# Altium schematic sheet 05-GPS_IMU_SENSORS.SchDoc
size Tabloid; Customer: 01910; SPICEModelCache: <root> / <DocumentId>YSTRYKDD</DocumentId> / <CacheFrame Number="0"> / <Model Name="emk105bj105_v-f" Kind="CKT"> / <Text>* EMK105BJ105_V-F     SPICE MODEL  ( General Type ) / *-------------------------------------------------------------------------------------------------------- / * Model Generated by TAIYO YUDEN Corporation (http://www.ty-top.com) / * Version 1.0 / * TAIYO YUDEN Control No. 170508_130520 / * Copyright(c) 2012 TAIYO YUDEN CO.,LTD. All Rights Reserved. / *-------------------------------------------------------------------------------------------------------- / * / * Products Name : Multilayer Ceramic Capacitors / * / * Characteristics : / *     Capacitance : 1 uF , Rated Voltage : 16V , TCC : X5R / *     Case Size : 1.0 x 0.5 / 0.039 x 0.02 [mm/inch] , Thickness : 0.5 / 0.02 [mm/inch] / *     (Conditions: Temperature = 25 degC , DC Bias Current/Voltage = 0A / 0V) / * / * Frequency Range : 40Hz - 3GHz / * / * External Node Assignments : / * / *  1  o---| |---o  2 / * / *-------------------------------------------------------------------------------------------------------- / .SubCkt EMK105BJ105_V-F 1 2 / **************************** / C0 1 110 0.68309u / Cm 1 101 0.26053u / C1 101 102 0.94076u / Rc1 101 102 1.9029k / C2 102 103 0.66707u / Rc2 102 103 120.36 / C3 103 110 0.57203u / Rc3 103 110 2.1097 / C2m 1 301 0.1871u / C21 301 302 3.2494u / Rc21 301 302 1.1117k / C22 302 303 2.1014u / Rc22 302 303 1.484k / C23 303 304 2.1172u / Rc23 303 304 1.3876k / C24 304 305 0.75729u / Rc24 304 305 332.59 / C25 305 306 0.94401u / Rc25 305 306 249.09 / C26 306 307 0.34674u / Rc26 306 307 28.352 / C27 307 308 0.37158u / Rc27 307 308 19.989 / C28 308 309 0.17933u / Rc28 308 309 31.748 / C29 309 110 0.016445u / Rc29 309 110 1.0592 / Rp0 1 110 100Meg / L0 110 120 0.2216n / Lm 120 130 0.1509n / L1 120 121 0.12659n / RL1 121 130 0.85161 / L2 120 122 0.15996n / RL2 122 130 0.42469 / L3 120 123 7.9543n / RL3 123 130 0.54643m / CR 120 124 0.24334u / LR 124 125 0.090738n / RR 125 130 68.076m / CL 130 140 2.7354p / LL 130 140 0.10762n / RL 130 140 50.614 / Rs 140 2 7.5416m / **************************** / .ends EMK105BJ105_V-F</Text> / </Model> / </CacheFrame> / </root>
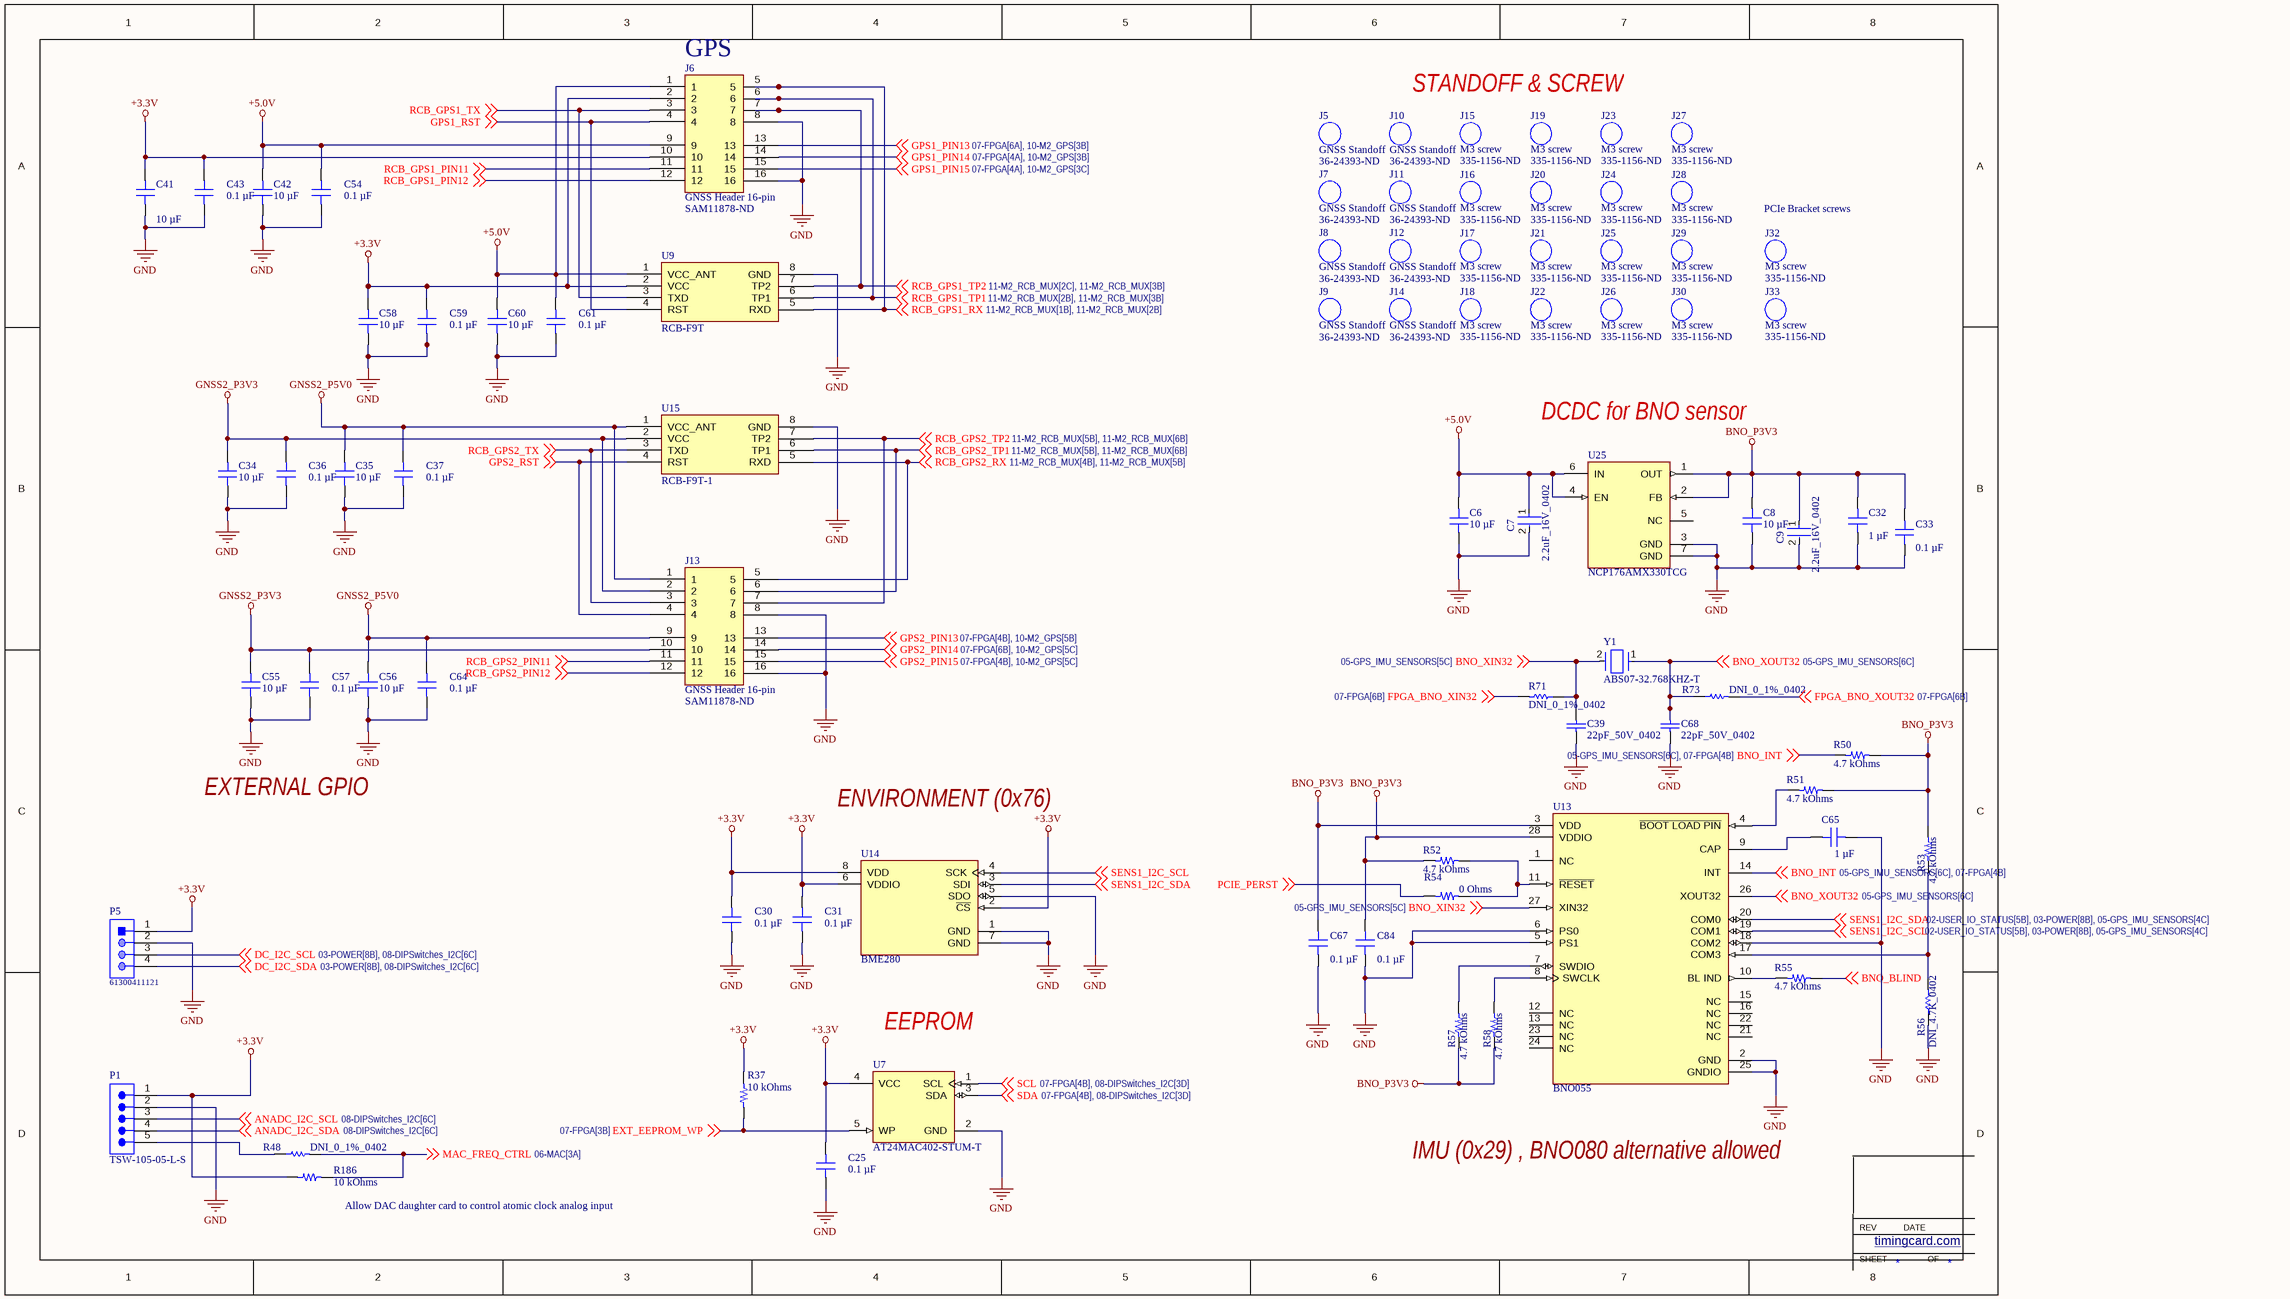
[diagram p0: 05-GPS_IMU_SENSORS.SchDoc]

## Parts
C6  10 µF  [MURATA GRM21B 0805_2012]
C7  2.2uF_16V_0402  [FP-C1005-050-0_05-IPC_A]
C8  10 µF  [MURATA GRM21B 0805_2012]
C9  2.2uF_16V_0402  [FP-C1005-050-0_05-IPC_A]
C25  0.1 µF  [CAP 0402_1005]
C30  0.1 µF  [CAP 0402_1005]
C31  0.1 µF  [CAP 0402_1005]
C32  1 µF  [CAP 0402_1005]
C33  0.1 µF  [CAP 0402_1005]
C34  10 µF  [MURATA GRM21B 0805_2012]
C35  10 µF  [MURATA GRM21B 0805_2012]
C36  0.1 µF  [CAP 0402_1005]
C37  0.1 µF  [CAP 0402_1005]
C39  22pF_50V_0402  [CAPC1005X55X25ML05T05]
C41  10 µF  [MURATA GRM21B 0805_2012]
C42  10 µF  [MURATA GRM21B 0805_2012]
C43  0.1 µF  [CAP 0402_1005]
C54  0.1 µF  [CAP 0402_1005]
C55  10 µF  [MURATA GRM21B 0805_2012]
C56  10 µF  [MURATA GRM21B 0805_2012]
C57  0.1 µF  [CAP 0402_1005]
C58  10 µF  [MURATA GRM21B 0805_2012]
C59  0.1 µF  [CAP 0402_1005]
C60  10 µF  [MURATA GRM21B 0805_2012]
C61  0.1 µF  [CAP 0402_1005]
C64  0.1 µF  [CAP 0402_1005]
C65  1 µF  [CAP 0402_1005]
C67  0.1 µF  [CAP 0402_1005]
C68  22pF_50V_0402  [CAPC1005X55X25ML05T05]
C84  0.1 µF  [CAP 0402_1005]
J5  GNSS Standoff  Supplier Part Number 1: 36-24393-ND
J6  GNSS Header 16-pin  Supplier Part Number 1: SAM11878-ND  [GNSS Header 16-pin]
J7  GNSS Standoff  Supplier Part Number 1: 36-24393-ND
J8  GNSS Standoff  Supplier Part Number 1: 36-24393-ND
J9  GNSS Standoff  Supplier Part Number 1: 36-24393-ND
J10  GNSS Standoff  Supplier Part Number 1: 36-24393-ND
J11  GNSS Standoff  Supplier Part Number 1: 36-24393-ND
J12  GNSS Standoff  Supplier Part Number 1: 36-24393-ND
J13  GNSS Header 16-pin  Supplier Part Number 1: SAM11878-ND  [GNSS Header 16-pin]
J14  GNSS Standoff  Supplier Part Number 1: 36-24393-ND
J15  M3 screw  Supplier Part Number 1: 335-1156-ND
J16  M3 screw  Supplier Part Number 1: 335-1156-ND
J17  M3 screw  Supplier Part Number 1: 335-1156-ND
J18  M3 screw  Supplier Part Number 1: 335-1156-ND
J19  M3 screw  Supplier Part Number 1: 335-1156-ND
J20  M3 screw  Supplier Part Number 1: 335-1156-ND
J21  M3 screw  Supplier Part Number 1: 335-1156-ND
J22  M3 screw  Supplier Part Number 1: 335-1156-ND
J23  M3 screw  Supplier Part Number 1: 335-1156-ND
J24  M3 screw  Supplier Part Number 1: 335-1156-ND
J25  M3 screw  Supplier Part Number 1: 335-1156-ND
J26  M3 screw  Supplier Part Number 1: 335-1156-ND
J27  M3 screw  Supplier Part Number 1: 335-1156-ND
J28  M3 screw  Supplier Part Number 1: 335-1156-ND
J29  M3 screw  Supplier Part Number 1: 335-1156-ND
J30  M3 screw  Supplier Part Number 1: 335-1156-ND
J32  M3 screw  Supplier Part Number 1: 335-1156-ND
J33  M3 screw  Supplier Part Number 1: 335-1156-ND
P1  TSW-105-05-L-S  [SMTC-TSW-105-05-X-S]
P5  61300411121  [61300411121]
R37  10 kOhms  [YAGEO RES 0402_1005]
R48  DNI_0_1%_0402  [RESC1005X40X25LL05T05]  (no BOM)
R50  4.7 kOhms  [YAGEO RES 0402_1005]
R51  4.7 kOhms  [YAGEO RES 0402_1005]
R52  4.7 kOhms  [YAGEO RES 0402_1005]
R53  4.7 kOhms  [YAGEO RES 0402_1005]
R54  0 Ohms  [YAGEO RES 0402_1005]
R55  4.7 kOhms  [YAGEO RES 0402_1005]
R56  DNI_4.7K_0402  [RESC1005X40X25LL05T05]  (no BOM)
R57  4.7 kOhms  [YAGEO RES 0402_1005]
R58  4.7 kOhms  [YAGEO RES 0402_1005]
R71  DNI_0_1%_0402  [RESC1005X40X25LL05T05]  (no BOM)
R73  DNI_0_1%_0402  [RESC1005X40X25LL05T05]  (no BOM)
R186  10 kOhms  [YAGEO RES 0402_1005]
U7  AT24MAC402-STUM-T  [FP-5TS1-IPC_C]
U9  RCB-F9T  [GNSS]
U13  BNO055  [FP-BNO055-MFG]
U14  BME280  [FP-BME280-MFG]
U15  RCB-F9T-1  [GNSS]
U25  NCP176AMX330TCG  [FP-711AT-MFG]
Y1  ABS07-32.768KHZ-T  [FP-ABS07-MFG]

## Nets
+3.3V: C25.2 C30.2 C31.2 C41.2 C43.2 C58.2 C59.2 J6.2 J6.10 P1.1 P5.1 R37.2 R186.1 U7.4(VCC) U9.2(VCC) U14.2(~{CS}) U14.6(VDDIO) U14.8(VDD)
+5.0V: C6.2 C7.1 C42.2 C54.2 C60.2 C61.2 J6.1 J6.9 U9.1(VCC_ANT) U25.4(EN) U25.6(IN)
BNO_P3V3: C8.2 C9.1 C32.2 C33.1 C67.2 C84.2 R50.1 R51.1 R52.2 R53.2 R57.1 R58.1 U13.3(VDD) U13.28(VDDIO) U25.1(OUT) U25.2(FB)
GND: C6.1 C7.2 C8.1 C9.2 C25.1 C30.1 C31.1 C32.1 C33.2 C34.1 C35.1 C36.1 C37.1 C39.1 C41.1 C42.1 C43.1 C54.1 C55.1 C56.1 C57.1 C58.1 C59.1 C60.1 C61.1 C64.1 C65.1 C67.1 C68.1 C84.1 J6.8 J6.16 J13.8 J13.16 P1.2 P5.2 R56.1 U7.2(GND) U9.8(GND) U13.2(GND) U13.5(PS1) U13.6(PS0) U13.18(COM2) U13.25(GNDIO) U14.1(GND) U14.5(SDO) U14.7(GND) U15.8(GND) U25.3(GND) U25.7(GND)
GNSS2_P3V3: C34.2 C36.2 C55.2 C57.2 J13.2 J13.10 U15.2(VCC)
GNSS2_P5V0: C35.2 C37.2 C56.2 C64.2 J13.1 J13.9 U15.1(VCC_ANT)
ANADC_I2C_SCL: P1.3 ; off-sheet ANADC_I2C_SCL
ANADC_I2C_SDA: P1.4 ; off-sheet ANADC_I2C_SDA
BNO_BLIND: R55.1 ; off-sheet BNO_BLIND
BNO_INT: R50.2 U13.14(INT) ; off-sheet BNO_INT
BNO_XIN32: C39.2 R71.1 U13.27(XIN32) Y1.2 ; off-sheet BNO_XIN32
BNO_XOUT32: C68.2 R73.1 U13.26(XOUT32) Y1.1 ; off-sheet BNO_XOUT32
DC_I2C_SCL: P5.3 ; off-sheet DC_I2C_SCL
DC_I2C_SDA: P5.4 ; off-sheet DC_I2C_SDA
EXT_EEPROM_WP: R37.1 U7.5(WP) ; off-sheet EXT_EEPROM_WP
FPGA_BNO_XIN32: R71.2 ; off-sheet FPGA_BNO_XIN32
FPGA_BNO_XOUT32: R73.2 ; off-sheet FPGA_BNO_XOUT32
GPS1_PIN13: J6.13 ; off-sheet GPS1_PIN13
GPS1_PIN14: J6.14 ; off-sheet GPS1_PIN14
GPS1_PIN15: J6.15 ; off-sheet GPS1_PIN15
GPS1_RST: J6.4 U9.4(RST) ; off-sheet GPS1_RST
GPS2_PIN13: J13.13 ; off-sheet GPS2_PIN13
GPS2_PIN14: J13.14 ; off-sheet GPS2_PIN14
GPS2_PIN15: J13.15 ; off-sheet GPS2_PIN15
GPS2_RST: J13.4 U15.4(RST) ; off-sheet GPS2_RST
MAC_FREQ_CTRL: R48.2 R186.2 ; off-sheet MAC_FREQ_CTRL
PCIE_PERST: R54.1 ; off-sheet PCIE_PERST
RCB_GPS1_PIN11: J6.11 ; off-sheet RCB_GPS1_PIN11
RCB_GPS1_PIN12: J6.12 ; off-sheet RCB_GPS1_PIN12
RCB_GPS1_RX: J6.5 U9.5(RXD) ; off-sheet RCB_GPS1_RX
RCB_GPS1_TP1: J6.6 U9.6(TP1) ; off-sheet RCB_GPS1_TP1
RCB_GPS1_TP2: J6.7 U9.7(TP2) ; off-sheet RCB_GPS1_TP2
RCB_GPS1_TX: J6.3 U9.3(TXD) ; off-sheet RCB_GPS1_TX
RCB_GPS2_PIN11: J13.11 ; off-sheet RCB_GPS2_PIN11
RCB_GPS2_PIN12: J13.12 ; off-sheet RCB_GPS2_PIN12
RCB_GPS2_RX: J13.5 U15.5(RXD) ; off-sheet RCB_GPS2_RX
RCB_GPS2_TP1: J13.6 U15.6(TP1) ; off-sheet RCB_GPS2_TP1
RCB_GPS2_TP2: J13.7 U15.7(TP2) ; off-sheet RCB_GPS2_TP2
RCB_GPS2_TX: J13.3 U15.3(TXD) ; off-sheet RCB_GPS2_TX
SCL: U7.1(SCL) ; off-sheet SCL
SDA: U7.3(SDA) ; off-sheet SDA
SENS1_I2C_SCL: U13.19(COM1) U14.4(SCK) ; off-sheet SENS1_I2C_SCL
SENS1_I2C_SDA: U13.20(COM0) U14.3(SDI) ; off-sheet SENS1_I2C_SDA
NetC65_2: C65.2 U13.9(CAP)
NetP1_5: P1.5 R48.1
NetR51_2: R51.2 U13.4(~{BOOT_LOAD_PIN})
NetR52_1: R52.1 R54.2 U13.11(~{RESET})
NetR53_1: R53.1 R56.2 U13.17(COM3)
NetR55_2: R55.2 U13.10(BL_IND)
NetR57_2: R57.2 U13.7(SWDIO)
NetR58_2: R58.2 U13.8(SWCLK)

Not connected (* = marked no-connect by the designer): U13 1(NC) 12(NC) 13(NC) 15(NC) 16(NC) 21(NC) 22(NC) 23(NC) 24(NC); U25 5(NC)

## Notes on the sheet
- (near J6) GPS
- STANDOFF & SCREW
- (near J32) PCIe Bracket screws
- DCDC for BNO sensor
- EXTERNAL GPIO
- ENVIRONMENT (0x76)
- EEPROM
- IMU (0x29) , BNO080 alternative allowed
- (near R186) Allow DAC daughter card to control atomic clock analog input
- SHEET
- REV
- timingcard.com <http://timingcard.com>
- DATE
- OF

## Library data of the parts
C6 C8 C34 C35 C41 C42 C55 C56 C58 C60 = GRM21BR61E106KA73L: CAP CER 10UF 25V X5R 0805; manufacturer: Murata Electronics; Tolerance: ±10%; packaging: TapeAndReel; Capacitance: 10 µF; series: GRM; Part Number: GRM21BR61E106KA73L; Value: 10 µF; Applications: General Purpose; componentlink1description: Datasheet; componentlink1url: https://search.murata.co.jp/Ceramy/image/img/A01X/G101/ENG/GRM21BR61E106KA73-01.pdf; componentlink2description: DigiKey Link; componentlink2url: https://www.digikey.com/en/products/detail/murata-electronics/GRM21BR61E106KA73L/2334874; Device Package: 0805 (2012 Metric); lastupdated: 27.08.2024 9:29:56; Lifecycle Status: Active; Minimum Order: 1; Mounting Type: Surface Mount, MLCC; Operating Temperature: -55°C ~ 85°C; Package / Case: 0805 (2012 Metric); partid: 8913; Part Status: Active; price: 0.04; Size / Dimension: 0.079" L x 0.049" W (2.00mm x 1.25mm); Supplier 1: DigiKey; Supplier Part Number 1: 490-5523-1-ND; Temperature Coefficient: X5R; Thickness (Max): 0.053" (1.35mm); Voltage - Rated: 25V
C7 C9 = CMP-2000-05998-2: Multilayer Ceramic Capacitors 2.2μF ±10% 16V X5R SMD 0402; Capacitance: 2.2uF; REACH SVHC: No SVHC; Series: C; Termination: SMD/SMT; Case Code (Imperial): 0402; Depth: 0.5mm; Mount: Surface Mount; Width: 0.02inch; Package Quantity: 1; Dielectric Material: Ceramic; Length: 1mm; Packaging: Tape and Reel; Case Code (Metric): 1005; RoHS Compliant: Yes; Dielectric: X5R; Max Operating Temperature: 85°C; Lead Free: Lead Free; Weight: 2.3E-05oz; Thickness: 0.022inch; Voltage Rating (DC): 16V; Tolerance: 10%; Voltage Rating: 16V; Resistor Type: Ceramic; Height: 0.5mm; Case/Package: 0402; Min Operating Temperature: -55°C
C25 C30 C31 C33 C36 C37 C43 C54 C57 C59 C61 C64 C67 C84 = CC0402KRX7R9BB104: CAP CER 0.1UF 50V X7R 0402; manufacturer: Yageo; Tolerance: ±10%; Part Number: CC0402KRX7R9BB104; Value: 0.1 µF; Applications: General Purpose; Capacitance: 0.1 µF; componentlink1description: Datasheet; componentlink1url: https://www.yageo.com/upload/media/product/productsearch/datasheet/mlcc/UPY-GPHC_X7R_6.3V-to-50V_18.pdf; componentlink2description: DigiKey Link; componentlink2url: https://www.digikey.com/en/products/detail/yageo/CC0402KRX7R9BB104/5883371; Device Package: 0402 (1005 Metric); lastupdated: 09.02.2024 20:04:27; Lifecycle Status: Active; Minimum Order: 10; Mounting Type: Surface Mount, MLCC; Operating Temperature: -55°C ~ 125°C; Package / Case: 0402 (1005 Metric); packaging: TapeAndReel; partid: 8451; Part Status: Active; price: 0.01; series: CC; Size / Dimension: 0.039" L x 0.020" W (1.00mm x 0.50mm); Supplier 1: DigiKey; Supplier Part Number 1: 311-3566-1-ND; Temperature Coefficient: X7R; Thickness (Max): 0.022" (0.55mm); Voltage - Rated: 50V
C32 C65 = CC0402KRX5R8BB105: CAP CER 1UF 25V X5R 0402; manufacturer: Yageo; Tolerance: ±10%; packaging: TapeAndReel; series: CC; Capacitance: 1 µF; Part Number: CC0402KRX5R8BB105; Value: 1 µF; Applications: General Purpose; componentlink1description: Datasheet; componentlink1url: https://www.yageo.com/upload/media/product/productsearch/datasheet/mlcc/UPY-GPHC_X5R_4V-to-50V_25.pdf; componentlink2description: DigiKey Link; componentlink2url: https://www.digikey.com/en/products/detail/yageo/CC0402KRX5R8BB105/5195107; Device Package: 0402 (1005 Metric); lastupdated: 09.02.2024 20:04:25; Lifecycle Status: Active; Minimum Order: 1; Mounting Type: Surface Mount, MLCC; Operating Temperature: -55°C ~ 85°C; Package / Case: 0402 (1005 Metric); partid: 9641; Part Status: Active; price: 0.04; Size / Dimension: 0.039" L x 0.020" W (1.00mm x 0.50mm); Supplier 1: DigiKey; Supplier Part Number 1: 311-1698-1-ND; Temperature Coefficient: X5R; Thickness (Max): 0.022" (0.55mm); Voltage - Rated: 25V
C39 C68 = CMP-2100-03590-1: Chip Capacitor, 22 pF, +/- 5%, 50 V, -55 to 125 degC, 0402 (1005 Metric), RoHS, Tape and Reel; Manufacturer: Yageo; Voltage Rating: 50V; Dielectric Material: Ceramic; Capacitance: 22pF; Temperature Coefficient: 30ppm/degC; Dielectric: C0G; Insulation Resistance: 100GR; Datasheet URL: http://www.yageo.com/NewPortal/yageodocoutput?fileName=/pdf/MLCC/UPY-GP_NP0_16V-to-50V_14.pdf; Depth: 0.5mm; Number of Pins: 2; Height: 0.5mm; Min Operating Temperature: -55degC; REACH SVHC: NoSVHC; Max Operating Temperature: 125degC; Voltage Rating (DC): 50V; Composition: Ceramic; Packaging: TapeandReel; Package Quantity: 1; Package Reference: 0402; Length: 1mm; Radiation Hardening: No; Package Description: 2-Pin Surface Mount Device, Body 1 x 0.5 mm; RoHSCompliant: True; Thickness: 0.022inch; Manufacturer URL: http://www.yageo.com/; Mount: SurfaceMount; Case Code (Metric): 1005; Case/Package: 0402; Tolerance: 5%; Termination: SMD/SMT; Width: 0.02inch; Datasheet Version: Rev. 14, 07/2016; Lead Free: LeadFree; Case Code (Imperial): 0402
P1 = CMP-1024-00366-1: 0.025" SQ Post Header, Through-hole, Vertical, -55 to 125 degC, 2.54 mm Pitch, 5-Pin, Male, RoHS; Manufacturer: Samtec; Pitch: 2.54 mm; PackageVersion: DM, 8/1988; PartNumber: TSW-105-05-L-S; Orientation: Vertical; Temperature Range: -55 to 125 degC; ComponentLink1Description: Manufacturer URL; PackageDescription: .025[0.64] SQ. Post Terminal Strip Assembly; ComponentLink2URL: http://www.samtec.com/documents/webfiles/pdf/TSW_TH.PDF; PackageReference: TSW-105-05-X-S; ComponentLink2Description: Datasheet; Mounting Technology: Through-hole; DatasheetVersion: F-214; ComponentLink1URL: http://www.samtec.com; RoHS: True; ComponentLink3URL: http://www.samtec.com/documents/webfiles/cpdf/TSW-XXX-XX-XXX-X-XX-XXX-MKT.pdf; ComponentLink3Description: Package Specification
P5 = CMP-1502-01064-1: THT Vertical Pin Header WR-PHD, Pitch 2.54 mm, Single Row, 4 pins; Manufacturer: Wurth Elektronik; Withstanding Voltage: 500VAC; Rated Current: 3A; Working Voltage: 250VAC; Pin Number: 4; Gender: Male; Contact Resistance: 20mOhm; Pitch: 2.54mm; Manufacturer URL: http://www.we-online.de; Operating Temperature: -40to105degC; Packaging: Bag; Mounting Technology: THT; Package Reference: 61300411121; Datasheet URL: https://katalog.we-online.de/em/datasheet/6130xx11121.pdf; Publisher: WurthElektronik; Part Number: 61300411121; Row Number: Single; Orientation: Vertical
R37 = RC0402FR-0710KL: RES 10K OHM 1% 1/16W 0402; Manufacturer: Yageo; Temperature Coefficient: ±100ppm/°C; Power (Watts): 0.063W, 1/16W; Package / Case: 0402 (1005 Metric); Features: Moisture Resistant; Packaging: CutTape; Series: RC_L; Tolerance: ±1%; Supplier Device Package: 0402; Number of Terminations: 2; Size / Dimension: 0.039" L x 0.020" W (1.00mm x 0.50mm); Operating Temperature: -55°C ~ 155°C; Composition: Thick Film; Part Number: RC0402FR-0710KL; Value: 10 kOhms; ComponentLink1Description: Datasheet; ComponentLink1URL: https://www.yageo.com/upload/media/product/productsearch/datasheet/rchip/PYu-RC_Group_51_RoHS_L_10.pdf; ComponentLink2Description: DigiKey Link; ComponentLink2URL: https://www.digikey.com/en/products/detail/yageo/RC0402FR-0710KL/726523; Device Package: 0402 (1005 Metric); Height - Seated (Max): 0.016" (0.40mm); LastUpdated: 25.07.2024 9:18:11; Lifecycle Status: Active; Minimum Order: 1; PartId: 17593; Part Status: Active; Price: 0.01; Resistance: 10 kOhms; Supplier 1: DigiKey; Supplier Part Number 1: 311-10.0KLRCT-ND
R48 R71 R73 = CMP-2000-07451-1: Chip Resistor, 0 Ohm, 0.1 W, -55 to 155 degC, 0402 (1005 Metric), RoHS, Tape and Reel; Manufacturer: Panasonic; Voltage Rating (DC): 50V; Temperature Coefficient: 600ppm/��C; Max Power Dissipation: 100mW; Resistance: 0mOhm; Tolerance: 5%; Number of Terminations: 2; Mount: SurfaceMount; Height: 0.35mm; Packaging: TapeandReel; Contact Plating: Tin; Manufacturer URL: http://www.panasonic.com/; Composition: ThickFilm; Max Operating Temperature: 155degC; REACH SVHC: NoSVHC; Case/Package: 0402; Package Reference: 402; Depth: 0.5mm; Package Description: 2-Pin Surface Mount Device, Body 1 x 0.5 mm; Datasheet URL: https://industrial.panasonic.com/cdbs/www-data/pdf/RDA0000/AOA0000C301.pdf; RoHSCompliant: True; Case Code (Imperial): 0402; Military Standard: Not; Min Operating Temperature: -55degC; Power Rating: 100mW; Datasheet Version: 03/2015; Length: 1mm; Case Code (Metric): 1005; Termination: SMD/SMT; Mounting Technology: SurfaceMount; Voltage Rating: 50V; Width: 0.02inch; Package Quantity: 1; Lead Free: LeadFree; Radiation Hardening: No
R50-R53 R55 R57 R58 = RC0402FR-074K7L: RES 4.7K OHM 1% 1/16W 0402; Manufacturer: Yageo; Power (Watts): 0.063W, 1/16W; Temperature Coefficient: ±100ppm/°C; Resistance: 4.7 kOhms; ComponentLink1Description: Datasheet; ComponentLink2Description: DigiKey Link; Tolerance: ±1%; ComponentLink1URL: https://www.yageo.com/upload/media/product/productsearch/datasheet/rchip/PYu-RC_Group_51_RoHS_L_10.pdf; Packaging: CutTape; ComponentLink2URL: https://www.digikey.com/en/products/detail/yageo/RC0402FR-074K7L/2827563; Part Number: RC0402FR-074K7L; Value: 4.7 kOhms; Composition: Thick Film; Device Package: 0402 (1005 Metric); Features: Moisture Resistant; Height - Seated (Max): 0.016" (0.40mm); LastUpdated: 25.07.2024 9:18:11; Lifecycle Status: Active; Minimum Order: 1; Number of Terminations: 2; Operating Temperature: -55°C ~ 155°C; Package / Case: 0402 (1005 Metric); PartId: 17603; Part Status: Active; Price: 0.01; Series: RC_L; Size / Dimension: 0.039" L x 0.020" W (1.00mm x 0.50mm); Supplier 1: DigiKey; Supplier Part Number 1: 311-4.7KLRCT-ND; Supplier Device Package: 0402
R54 = RC0402FR-070RL: RES 0 OHM JUMPER 1/16W 0402; Manufacturer: Yageo; Power (Watts): 0.063W, 1/16W; Number of Terminations: 2; Packaging: CutTape; Composition: Thick Film; Resistance: 0 Ohms; Tolerance: Jumper; Part Number: RC0402FR-070RL; Value: 0 Ohms; ComponentLink1Description: Datasheet; ComponentLink1URL: https://www.yageo.com/upload/media/product/productsearch/datasheet/rchip/PYu-RC_Group_51_RoHS_L_10.pdf; ComponentLink2Description: DigiKey Link; ComponentLink2URL: https://www.digikey.com/en/products/detail/yageo/RC0402FR-070RL/2827570; Device Package: 0402 (1005 Metric); Features: Moisture Resistant; Height - Seated (Max): 0.016" (0.40mm); LastUpdated: 25.07.2024 9:18:11; Lifecycle Status: Active; Minimum Order: 1; Operating Temperature: -55°C ~ 155°C; Package / Case: 0402 (1005 Metric); PartId: 17630; Part Status: Active; Price: 0.01; Series: RC_L; Size / Dimension: 0.039" L x 0.020" W (1.00mm x 0.50mm); Supplier 1: DigiKey; Supplier Part Number 1: 311-0.0LRCT-ND; Supplier Device Package: 0402
R56 = CMP-2002-01154-4: Chip Resistor, 4.7 KOhm, +/- 1%, 0.1 W, -55 to 155 degC, 0402 (1005 Metric), RoHS, Tape and Reel; PartNumber: ERJ-2RKF4701X; Voltage Rating: 50 V; Case\/Package: 0402; Power Rating: 100 mW; Height: 0.35 mm; Mounting Technology: Surface Mount; REACH SVHC: Yes; Resistance: 4.7 KOhm; Max Operating Temperature: 155 degC; ComponentLink1Description: Manufacturer URL; ComponentLink2Description: Datasheet; Pins: 2; PackageReference: 0402; Tolerance: 1%; Case Code (Imperial): 0402; Length: 1 mm; PackageDescription: 2-Pin Surface Mount Device, Body 1 x 0.5 mm; RoHSCompliant: true; Package Quantity: 1; Radiation Hardening: No; DatasheetVersion: 04/2015; Width: 0.5 mm; Case Code (Metric): 1005; Mount: Surface Mount; ComponentLink1URL: http://www.panasonic.com/; Min Operating Temperature: -55 degC; Packaging: Cut Tape; ComponentLink2URL: http://industrial.panasonic.com/cdbs/www-data/pdf/RDA0000/AOA0000C86.pdf
R186 = RC0402FR-0710KL: RES 10K OHM 1% 1/16W 0402; Manufacturer: Yageo; Power (Watts): 0.063W, 1/16W; Temperature Coefficient: ±100ppm/°C; Part Number: RC0402FR-0710KL; Value: 10 kOhms; ComponentLink1Description: Datasheet; ComponentLink1URL: https://www.yageo.com/upload/media/product/productsearch/datasheet/rchip/PYu-RC_Group_51_RoHS_L_10.pdf; ComponentLink2Description: DigiKey Link; ComponentLink2URL: https://www.digikey.com/en/products/detail/yageo/RC0402FR-0710KL/726523; Composition: Thick Film; Device Package: 0402 (1005 Metric); Features: Moisture Resistant; Height - Seated (Max): 0.016" (0.40mm); LastUpdated: 25.07.2024 9:18:11; Lifecycle Status: Active; Minimum Order: 1; Number of Terminations: 2; Operating Temperature: -55°C ~ 155°C; Package / Case: 0402 (1005 Metric); Packaging: CutTape; PartId: 17593; Part Status: Active; Price: 0.01; Resistance: 10 kOhms; Series: RC_L; Size / Dimension: 0.039" L x 0.020" W (1.00mm x 0.50mm); Supplier 1: DigiKey; Supplier Part Number 1: 311-10.0KLRCT-ND; Supplier Device Package: 0402; Tolerance: ±1%
U7 = CMP-06313-000011-1: IC EEPROM 2K I2C 1MHZ SOT23-5; Manufacturer: Microchip; Memory Size: 2Kbits; Min Supply Voltage: 1.7V; Max Supply Voltage: 5.5V; Frequency: 1000kHz; Standoff Height: 0mm; Nominal Supply Current: 0.4-2mA; Access Time: 0.55us; Interface: I2C,2-Wire; Temperature Range Low: -40°C; Height: 1mm; ComponentLink2URL: http://ww1.microchip.com/downloads/en/DeviceDoc/Atmel-8807-SEEPROM-AT24MAC402-602-Datasheet.pdf; Ipc Land Pattern Name: SOT95P280X100-5; Category: IC; Memory Type: EEPROM; Digikey Description: IC EEPROM 2K I2C 1MHZ SOT23-5; Manufacturer Part Number: AT24MAC402-STUM-T; Device Class L1: Integrated Circuits (ICs); Temperature Range High: +85°C; ComponentLink2Description: Datasheet; RoHS: TRUE; Mouser Description: EEPROM Serial-I2C 2K-bit 256 x 8 1.8V/2.5V/3.3V/5V 5-Pin SOT-23 T/R; Octopart: https://octopart.com/at24mac402-stum-t-microchip-77758112; Temperature: -40°C to +85°C; Package: 5TS1; Device Class L3: EEPROM; Automotive: No; Device Class L2: Memory; Lead Free: Yes
U9 U15 = RCB-F9T: MOD, GPS; VELENTIUM PART NUM: <V PART NUM>; MFG NAME: UBLOCKS; MINTEMP: -40C; MAXTEMP: 80C; DESC: MOD BLE 4.2; CATEGORY: MOD; MODIFY DATE: 9/11/13; P1: GPS; SHEETPART: *; DATE: .; Supplier 1: Digi-Key; Supplier Part Number 1: 672-RCB-F9T-ND
  U9: MFG PART NUM: RCB-F9T
  U15: MFG PART NUM: RCB-F9T-1
U13 = CMP-2000-05075-4: IMU ACCEL/GYRO/MAG I2C 28LGA; Sensor Type: Accelerometer; Packaging: Tape and Reel; Case/Package: LGA; Min Operating Temperature: -40°C; Mount: Surface Mount; Output Type: I2C; Lead Free: Lead Free; Max Operating Temperature: 85°C
U14 = CMP-2000-05073-3: SENSOR PRESSURE HUMIDITY TEMP; Sensor Type: Temperature; Accuracy: 3%; Response Time: 1s; Output Type: SPI; Min Operating Temperature: -40°C; Max Operating Temperature: 85°C; Case/Package: LGA; Packaging: Cut Tape; Mount: Surface Mount; Lead Free: Lead Free; Number of Pins: 8
U25 = CMP-07128-000022-1: IC REG LINEAR 3.3V 500MA 6XDFN; Manufacturer: ON Semiconductor; Output Type: Fixed; Dropout Voltage: 295mV; Number Of Outputs: 1; Standoff Height: 0mm; Min Supply Voltage: 1.4V; Nominal Supply Current: 60uA; Max Supply Voltage: 5.5V; Max Junction Temp: +150°C; Accuracy Percentage: 0.8%; Footprint Url: https://www.onsemi.com/pub/Collateral/711AT.PDF; Device Class L2: Power Management ICs; Device Class L1: Integrated Circuits (ICs); Digikey Description: IC REG LINEAR 3.3V 500MA 6XDFN; ComponentLink2Description: Datasheet; Output Voltage: 3.3V; ComponentLink2URL: https://www.onsemi.com/pub/Collateral/NCP176-D.PDF; RoHS: TRUE; Lead Free: Yes; Output Current: 500mA; Automotive: No; Temperature Range High: +150°C; Height: 0.45mm; Package: 711AT; Device Class L3: Voltage Regulators - Linear; Octopart: https://octopart.com/ncp176amx330tcg-on+semiconductor-61522616; Category: IC; Manufacturer Part Number: NCP176AMX330TCG; Ipc Land Pattern Name: DFN120X120X37-6; Temperature: to +150°C
Y1 = CMP-0447-00001-4: Crystal 32.768kHz ±20ppm (Tol) 12.5pF FUND 70kΩ 2-Pin CSMD T/R; ESR (Equivalent Series Resistance): 70kR; Radiation Hardening: No; Frequency: 32.768kHz; Length: 3.2mm; Max Operating Temperature: 85°C; Number of Pins: 2; Series: ABS07; Min Operating Temperature: -40°C; Frequency Tolerance: 20ppm; Packaging: Tape and Reel; Height: 0.9mm; Width: 1.5mm; Depth: 1.5mm; Load Capacitance: 12.5pF; RoHS Compliant: Yes; Tolerance: 20ppm; Termination: SMD/SMT; Lead Free: Lead Free; Series Resistance: 70kR; REACH SVHC: No SVHC; Case/Package: CSMD; Operating Frequency: 32.768 kHz; Package Quantity: 3000
J5 J7-J12 J14 = GNSS Standoff: Supplier 1: Digi-Key
J6 J13 = GNSS Header 16-pin: Supplier 1: Digi-Key
J15-J30 J32 J33 = M3 screw: Supplier 1: Digi-Key